# EAGLE design Stereo Jack Board (EAGLE 9.5.2)
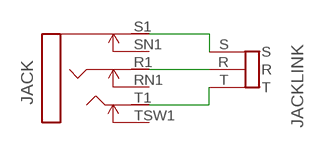
[diagram p0: schematic, sheet 1]

## Parts
JACK  BLMS-STEREO-SWBLMSJ6HC-S-PLAIN  [BLMSJ6HC-S-PLAIN]
JACKLINK  JACKLINKJACKLINK-TSR  [JACKLINK-TSR]

## Nets
N$1: JACK.S1(S) JACKLINK.S
N$2: JACK.R1(R) JACKLINK.R
N$3: JACK.T1(T) JACKLINK.T
Unconnected: JACK.RN1(RN) JACK.SN1(SN) JACK.TSW1(TN)

## Library data of the parts
JACK = mb_jacks:BLMS-STEREO-SW: BLMS 1/4" Stereo Switched jack with 20mm body
JACKLINK = xc_library:JACKLINK: Jacklink for Stereo Jack

## Board
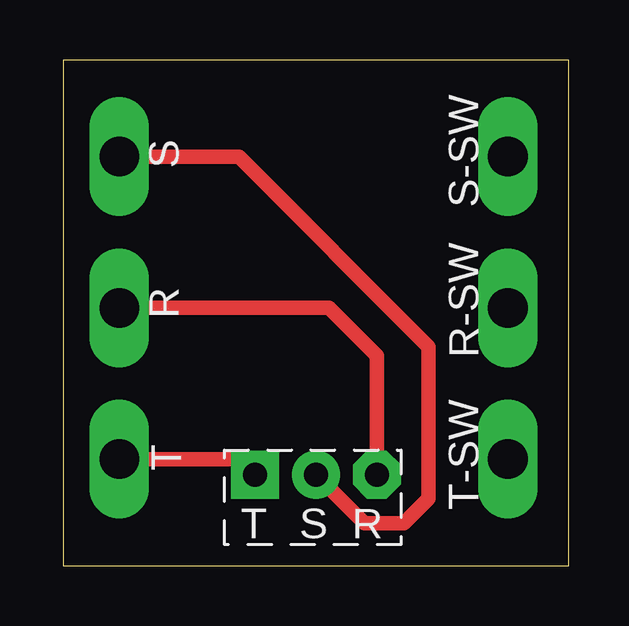
[diagram p1: board, top side]

Size 21.08 x 21.08 mm. Coordinates in mm from the lower left corner, seen from the top.
Outline: 0,0 21.08,0 21.08,21.08 0,21.08 0,0
Copper layers (1*16): Top 0.035559375mm / dielectric 1.6mm / Bottom 0.035559375mm
Design rules "oshpark-2layer": minimum track width 6mil, minimum drill 10mil, track to track 6mil, track to pad 6mil, pad to pad 6mil, via to via 6mil, smd to smd 6mil, copper to edge 15mil, drill to drill 6mil, minimum pad ring 5mil, minimum via ring 5mil, stop-mask expansion 2.5mil, vias tented up to drill 0mil, thermal gap 10mil

### Footprints (pad centres in the part's own frame; a part is rotated, then mirrored left to right if it is on the bottom)
BLMSJ6HC-S-PLAIN = drill 1.651 pad 1.93 long: R1 10.5,18.1; RN1 10.5,1.9; S1 16.8,18.1; SN1 16.8,1.9; T1 4.2,18.1; TSW1 4.2,1.9
JACKLINK-TSR = drill 1 pad 2 octagon: R -2.54,0 | drill 1 pad 2: S 0,0 | drill 1 pad 2 square: T 2.54,0

### Placement (x,y rotation side)
JACK  20.45,0.25 90 top
JACKLINK  10.54,3.81 180 top

### Tracks (layer width: path | path; a pad name or v marks a point on that pad's centre or on a via)
N$1
  Top 0.61: JACK.S1 7.33,17.05 15.24,9.14 15.24,2.79 14.22,1.78 12.57,1.78 JACKLINK.S
N$2
  Top 0.61: JACK.R1 11.09,10.75 13.08,8.76 JACKLINK.R
N$3
  Top 0.61: JACK.T1 7.36,4.45 JACKLINK.T